# Altium project isg_cena_host_board_rev1.PrjPcb (part 1 of 2)
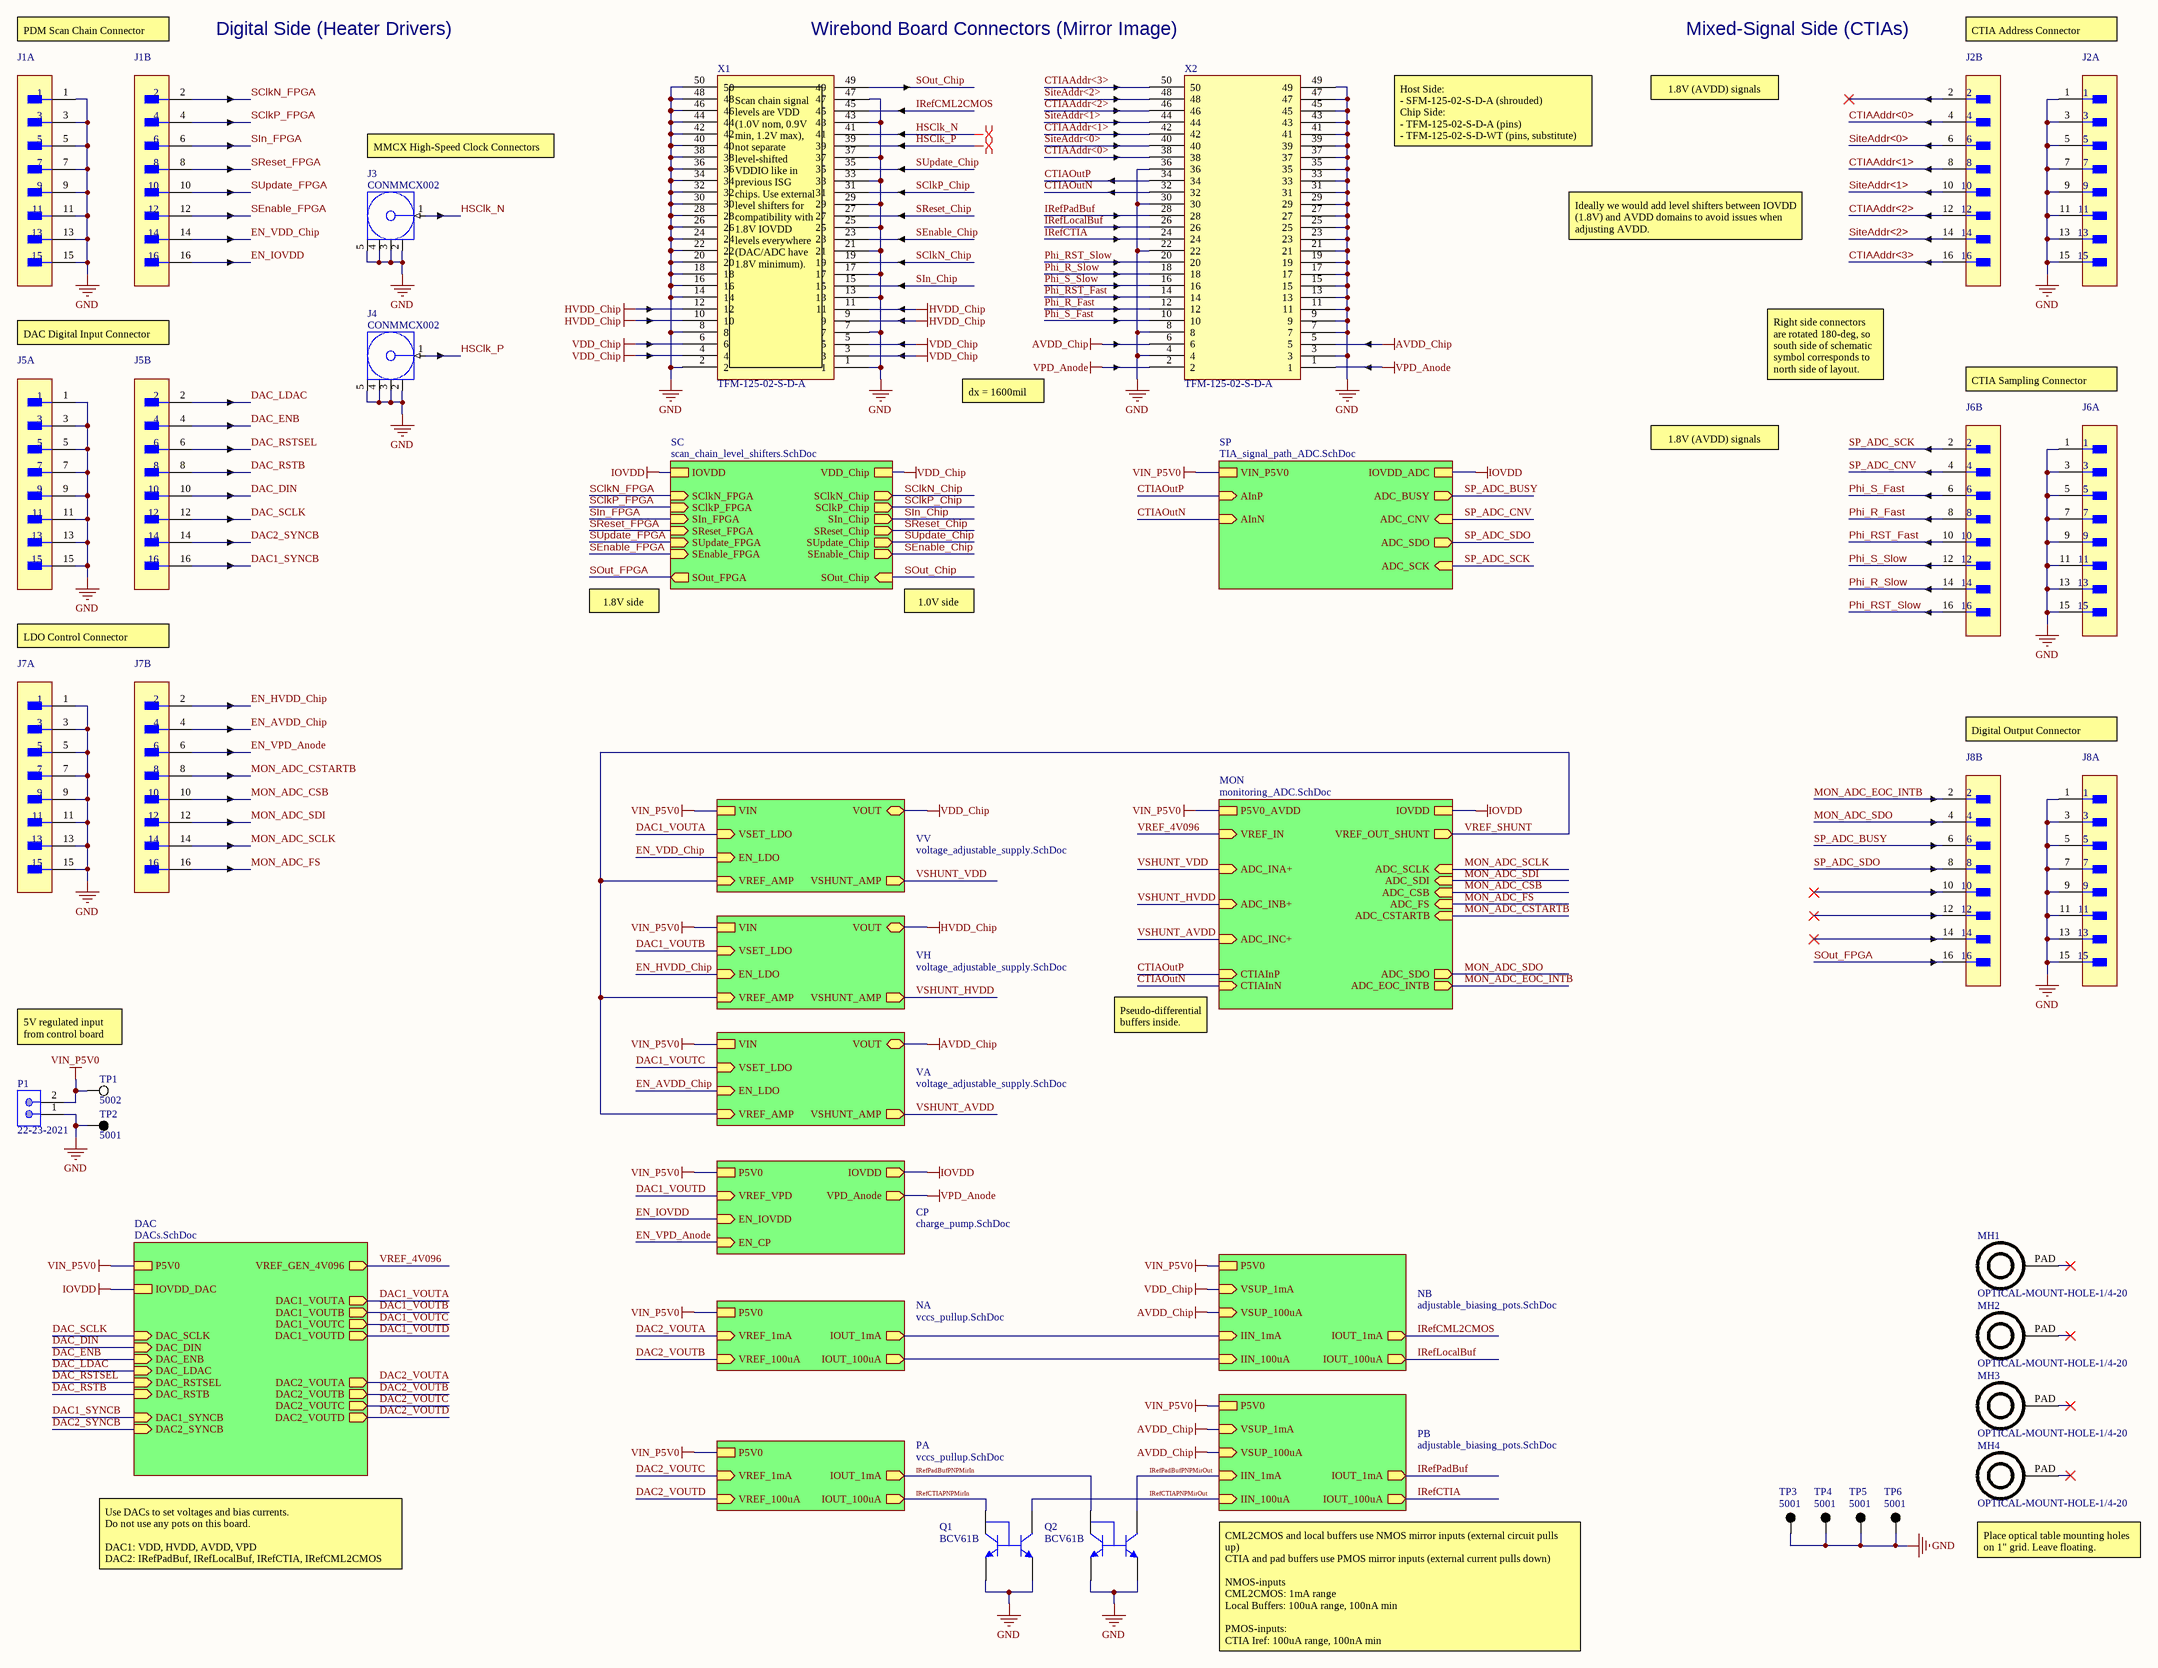
[diagram p0: isg_cena_host_board_rev1_top.SchDoc]
9 sheets, 317 parts. Net scope: hierarchical (ports join the sheet entries above them; power ports are global).
Board file: isg_cena_host_board_rev1.PcbDoc
Sheets:
  isg_cena_host_board_rev1_top.SchDoc
    VV = voltage_adjustable_supply.SchDoc
    VH = voltage_adjustable_supply.SchDoc
    VA = voltage_adjustable_supply.SchDoc
    NA = vccs_pullup.SchDoc
    PA = vccs_pullup.SchDoc
    PB = adjustable_biasing_pots.SchDoc
    NB = adjustable_biasing_pots.SchDoc
    CP = charge_pump.SchDoc
    DAC = DACs.SchDoc
    SP = TIA_signal_path_ADC.SchDoc
    SC = scan_chain_level_shifters.SchDoc
    MON = monitoring_ADC.SchDoc

## Sheet isg_cena_host_board_rev1_top.SchDoc
size C; SheetNumber: 1; SheetTotal: 9

### Parts
(Parts that share a designator on the sheet are numbered #1, #2 ... from top to bottom, then left to right.)
J1  (no value)  [FP-FTSH-108-02-F-DV]  (parts A,B of 2)
J2  (no value)  [FP-FTSH-108-02-F-DV]  (parts A,B of 2)
J3  CONMMCX002  [CON-MMCX-RA]
J4  CONMMCX002  [CON-MMCX-RA]
J5  (no value)  [FP-FTSH-108-02-F-DV]  (parts A,B of 2)
J6  (no value)  [FP-FTSH-108-02-F-DV]  (parts A,B of 2)
J7  (no value)  [FP-FTSH-108-02-F-DV]  (parts A,B of 2)
J8#1  (no value)  [FP-FTSH-108-02-F-DV]  (parts A,B of 2)
MH1  OPTICAL-MOUNT-HOLE-1/4-20  [MH-1/4-20]
MH2  OPTICAL-MOUNT-HOLE-1/4-20  [MH-1/4-20]
MH3  OPTICAL-MOUNT-HOLE-1/4-20  [MH-1/4-20]
MH4  OPTICAL-MOUNT-HOLE-1/4-20  [MH-1/4-20]
P1  22-23-2021  [MOLX-22-23-2021_V]
Q1  BCV61B  [INF-SOT143-4-1_V]
Q2  BCV61B  [INF-SOT143-4-1_V]
TP1  5002  [KSTN-5002]
TP2  5001  [KSTN-5001]
TP3  5001  [KSTN-5001]
TP4  5001  [KSTN-5001]
TP5  5001  [KSTN-5001]
TP6  5001  [KSTN-5001]
X1  TFM-125-02-S-D-A  [SAMTEC-TFM-125-02-X-D-A]
X2  TFM-125-02-S-D-A  [SAMTEC-TFM-125-02-X-D-A]

### Sub-sheets
CP = charge_pump.SchDoc: P5V0, EN_CP (in), IOVDD (out), VPD_Anode (out), VREF_VPD (in), EN_IOVDD (in)
DAC = DACs.SchDoc: P5V0, IOVDD_DAC, DAC1_VOUTA (out), DAC1_VOUTB (out), DAC1_VOUTC (out), DAC1_VOUTD (out), DAC2_VOUTA (out), DAC2_VOUTB (out), DAC2_VOUTC (out), DAC2_VOUTD (out), DAC_SCLK (in), DAC_DIN (in), DAC1_SYNCB (in), DAC_ENB (in), DAC_LDAC (in), DAC_RSTSEL (in), DAC_RSTB (in), DAC2_SYNCB (in), VREF_GEN_4V096 (out)
MON = monitoring_ADC.SchDoc: P5V0_AVDD, IOVDD, ADC_INA+ (in), ADC_INB+ (in), ADC_INC+ (in), CTIAInP (in), CTIAInN (in), ADC_SCLK (in), ADC_SDI (in), ADC_SDO (out), ADC_CSB (in), ADC_FS (in), ADC_CSTARTB (in), ADC_EOC_INTB (out), VREF_IN (in), VREF_OUT_SHUNT (out)
NA = vccs_pullup.SchDoc: P5V0, VREF_1mA (in), VREF_100uA (in), IOUT_1mA (out), IOUT_100uA (out)
NB = adjustable_biasing_pots.SchDoc: VSUP_1mA (in), IIN_1mA (in), IIN_100uA (in), IOUT_1mA (out), IOUT_100uA (out), VSUP_100uA (in), P5V0
PA = vccs_pullup.SchDoc: P5V0, VREF_1mA (in), VREF_100uA (in), IOUT_1mA (out), IOUT_100uA (out)
PB = adjustable_biasing_pots.SchDoc: VSUP_1mA (in), IIN_1mA (in), IIN_100uA (in), IOUT_1mA (out), IOUT_100uA (out), VSUP_100uA (in), P5V0
SC = scan_chain_level_shifters.SchDoc: VDD_Chip, IOVDD, SClkN_FPGA (in), SClkP_FPGA (in), SIn_FPGA (in), SReset_FPGA (in), SUpdate_FPGA (in), SEnable_FPGA (in), SClkN_Chip (out), SClkP_Chip (out), SIn_Chip (out), SReset_Chip (out), SUpdate_Chip (out), SEnable_Chip (out), SOut_FPGA (out), SOut_Chip (in)
SP = TIA_signal_path_ADC.SchDoc: VIN_P5V0, AInP (in), AInN (in), IOVDD_ADC, ADC_BUSY (out), ADC_CNV (in), ADC_SDO (out), ADC_SCK (in)
VA = voltage_adjustable_supply.SchDoc: VIN, VOUT (bidir), VSET_LDO (in), EN_LDO (in), VSHUNT_AMP (out), VREF_AMP (in)
VH = voltage_adjustable_supply.SchDoc: VIN, VOUT (bidir), VSET_LDO (in), EN_LDO (in), VSHUNT_AMP (out), VREF_AMP (in)
VV = voltage_adjustable_supply.SchDoc: VIN, VOUT (bidir), VSET_LDO (in), EN_LDO (in), VSHUNT_AMP (out), VREF_AMP (in)

### Nets
AVDD_Chip: X2.5 X2.6 ; sheet VA/VOUT, sheet PB/VSUP_1mA, sheet PB/VSUP_100uA, sheet NB/VSUP_100uA  [project net VOUT]
GND: J1.1 J1.3 J1.5 J1.7 J1.9 J1.11 J1.13 J1.15 J2.1 J2.3 J2.5 J2.7 J2.9 J2.11 J2.13 J2.15 J3.2(GND) J3.3(GND) J3.4(GND) J3.5(GND) J4.2(GND) J4.3(GND) J4.4(GND) J4.5(GND) J5.1 J5.3 J5.5 J5.7 J5.9 J5.11 J5.13 J5.15 J6.1 J6.3 J6.5 J6.7 J6.9 J6.11 J6.13 J6.15 J7.1 J7.3 J7.5 J7.7 J7.9 J7.11 J7.13 J7.15 J8#1.1 J8#1.3 J8#1.5 J8#1.7 J8#1.9 J8#1.11 J8#1.13 J8#1.15 P1.1 Q1.3(E1) Q1.4(E2) Q2.3(E1) Q2.4(E2) TP2.1 TP3.1 TP4.1 TP5.1 TP6.1 X1.1 X1.2 X1.7 X1.8 X1.13 X1.14 X1.16 X1.17 X1.18 X1.20 X1.21 X1.22 X1.24 X1.25 X1.26 X1.28 X1.29 X1.30 X1.32 X1.33 X1.34 X1.36 X1.37 X1.38 X1.40 X1.42 X1.43 X1.44 X1.46 X1.47 X1.48 X1.50 X2.3 X2.4 X2.7 X2.8 X2.9 X2.11 X2.13 X2.15 X2.17 X2.19 X2.21 X2.22 X2.23 X2.25 X2.27 X2.29 X2.30 X2.31 X2.33 X2.35 X2.36 X2.37 X2.39 X2.41 X2.43 X2.45 X2.47 X2.49
HVDD_Chip: X1.9 X1.10 X1.11 X1.12 ; sheet VH/VOUT  [project net VOUT]
IOVDD: sheet CP/IOVDD, sheet DAC/IOVDD_DAC, sheet SP/IOVDD_ADC, sheet SC/IOVDD, sheet MON/IOVDD
VDD_Chip: X1.3 X1.4 X1.5 X1.6 ; sheet VV/VOUT, sheet NB/VSUP_1mA, sheet SC/VDD_Chip  [project net VOUT]
VIN_P5V0: P1.2 TP1.1 ; sheet VV/VIN, sheet VH/VIN, sheet VA/VIN, sheet NA/P5V0, sheet PA/P5V0, sheet PB/P5V0, sheet NB/P5V0, sheet CP/P5V0, sheet DAC/P5V0, sheet SP/VIN_P5V0, sheet MON/P5V0_AVDD  [project net P5V0]
VPD_Anode: X2.1 X2.2 ; sheet CP/VPD_Anode
CTIAAddr<0>: J2.4 X2.38
CTIAAddr<1>: J2.8 X2.42
CTIAAddr<2>: J2.12 X2.46
CTIAAddr<3>: J2.16 X2.50
CTIAOutN: X2.32 ; sheet SP/AInN, sheet MON/CTIAInN
CTIAOutP: X2.34 ; sheet SP/AInP, sheet MON/CTIAInP
DAC1_SYNCB: J5.16 ; sheet DAC/DAC1_SYNCB
DAC1_VOUTA: sheet VV/VSET_LDO, sheet DAC/DAC1_VOUTA
DAC1_VOUTB: sheet VH/VSET_LDO, sheet DAC/DAC1_VOUTB
DAC1_VOUTC: sheet VA/VSET_LDO, sheet DAC/DAC1_VOUTC
DAC1_VOUTD: sheet CP/VREF_VPD, sheet DAC/DAC1_VOUTD
DAC2_SYNCB: J5.14 ; sheet DAC/DAC2_SYNCB
DAC2_VOUTA: sheet NA/VREF_1mA, sheet DAC/DAC2_VOUTA
DAC2_VOUTB: sheet NA/VREF_100uA, sheet DAC/DAC2_VOUTB
DAC2_VOUTC: sheet PA/VREF_1mA, sheet DAC/DAC2_VOUTC
DAC2_VOUTD: sheet PA/VREF_100uA, sheet DAC/DAC2_VOUTD
DAC_DIN: J5.10 ; sheet DAC/DAC_DIN
DAC_ENB: J5.4 ; sheet DAC/DAC_ENB
DAC_LDAC: J5.2 ; sheet DAC/DAC_LDAC
DAC_RSTB: J5.8 ; sheet DAC/DAC_RSTB
DAC_RSTSEL: J5.6 ; sheet DAC/DAC_RSTSEL
DAC_SCLK: J5.12 ; sheet DAC/DAC_SCLK
EN_AVDD_Chip: J7.4 ; sheet VA/EN_LDO  [project net EN]
EN_HVDD_Chip: J7.2 ; sheet VH/EN_LDO  [project net EN]
EN_IOVDD: J1.16 ; sheet CP/EN_IOVDD
EN_VDD_Chip: J1.14 ; sheet VV/EN_LDO  [project net EN]
EN_VPD_Anode: J7.6 ; sheet CP/EN_CP  [project net CP_EN_M]
HSClk_N: J3.1(Signal) X1.41
HSClk_P: J4.1(Signal) X1.39
IOUT_1mA: sheet NA/IOUT_1mA, sheet NB/IIN_1mA
IOUT_100uA: sheet NA/IOUT_100uA, sheet NB/IIN_100uA
IRefCML2CMOS: X1.45 ; sheet NB/IOUT_1mA
IRefCTIA: X2.24 ; sheet PB/IOUT_100uA
IRefCTIAPNPMirIn: Q1.1(C2) ; sheet PA/IOUT_100uA  [project net IOUT_100uA]
IRefCTIAPNPMirOut: Q1.2(C1) ; sheet PB/IIN_100uA
IRefLocalBuf: X2.26 ; sheet NB/IOUT_100uA
IRefPadBuf: X2.28 ; sheet PB/IOUT_1mA
IRefPadBufPNPMirIn: Q2.1(C2) ; sheet PA/IOUT_1mA  [project net IOUT_1mA]
IRefPadBufPNPMirOut: Q2.2(C1) ; sheet PB/IIN_1mA
MON_ADC_CSB: J7.10 ; sheet MON/ADC_CSB
MON_ADC_CSTARTB: J7.8 ; sheet MON/ADC_CSTARTB
MON_ADC_EOC_INTB: J8#1.2 ; sheet MON/ADC_EOC_INTB
MON_ADC_FS: J7.16 ; sheet MON/ADC_FS
MON_ADC_SCLK: J7.14 ; sheet MON/ADC_SCLK
MON_ADC_SDI: J7.12 ; sheet MON/ADC_SDI
MON_ADC_SDO: J8#1.4 ; sheet MON/ADC_SDO
Phi_R_Fast: J6.8 X2.12
Phi_R_Slow: J6.14 X2.18
Phi_RST_Fast: J6.10 X2.14
Phi_RST_Slow: J6.16 X2.20
Phi_S_Fast: J6.6 X2.10
Phi_S_Slow: J6.12 X2.16
SClkN_Chip: X1.19 ; sheet SC/SClkN_Chip
SClkN_FPGA: J1.2 ; sheet SC/SClkN_FPGA
SClkP_Chip: X1.31 ; sheet SC/SClkP_Chip
SClkP_FPGA: J1.4 ; sheet SC/SClkP_FPGA
SEnable_Chip: X1.23 ; sheet SC/SEnable_Chip
SEnable_FPGA: J1.12 ; sheet SC/SEnable_FPGA
SIn_Chip: X1.15 ; sheet SC/SIn_Chip
SIn_FPGA: J1.6 ; sheet SC/SIn_FPGA
SiteAddr<0>: J2.6 X2.40
SiteAddr<1>: J2.10 X2.44
SiteAddr<2>: J2.14 X2.48
SOut_Chip: X1.49 ; sheet SC/SOut_Chip
SOut_FPGA: J8#1.16 ; sheet SC/SOut_FPGA
SP_ADC_BUSY: J8#1.6 ; sheet SP/ADC_BUSY
SP_ADC_CNV: J6.4 ; sheet SP/ADC_CNV  [project net ADC_CNV]
SP_ADC_SCK: J6.2 ; sheet SP/ADC_SCK  [project net ADC_SCK]
SP_ADC_SDO: J8#1.8 ; sheet SP/ADC_SDO  [project net ADC_SDO]
SReset_Chip: X1.27 ; sheet SC/SReset_Chip
SReset_FPGA: J1.8 ; sheet SC/SReset_FPGA
SUpdate_Chip: X1.35 ; sheet SC/SUpdate_Chip
SUpdate_FPGA: J1.10 ; sheet SC/SUpdate_FPGA
VREF_4V096: sheet DAC/VREF_GEN_4V096, sheet MON/VREF_IN  [project net DAC_VREF_4V096]
VREF_SHUNT: sheet VV/VREF_AMP, sheet VH/VREF_AMP, sheet VA/VREF_AMP, sheet MON/VREF_OUT_SHUNT
VSHUNT_AVDD: sheet VA/VSHUNT_AMP, sheet MON/ADC_INC+
VSHUNT_HVDD: sheet VH/VSHUNT_AMP, sheet MON/ADC_INB+
VSHUNT_VDD: sheet VV/VSHUNT_AMP, sheet MON/ADC_INA+

Not connected (* = marked no-connect by the designer): J2 2*; J8#1 10* 12* 14*; MH1 PAD*; MH2 PAD*; MH3 PAD*; MH4 PAD*

### Layout directives
differential pair: HSClk_N, HSClk_P

### Notes on the sheet
- PDM Scan Chain Connector
- Digital Side (Heater Drivers)
- Wirebond Board Connectors (Mirror Image)
- Mixed-Signal Side (CTIAs)
- CTIA Address Connector
- 1.8V (AVDD) signals
- MMCX High-Speed Clock Connectors
- Host Side:
  - SFM-125-02-S-D-A (shrouded)
  Chip Side:
  - TFM-125-02-S-D-A (pins)
  - TFM-125-02-S-D-WT (pins, substitute)
- Ideally we would add level shifters between IOVDD (1.8V) and AVDD domains to avoid issues when adjusting AVDD.
- DAC Digital Input Connector
- (near X1) Scan chain signal levels are VDD (1.0V nom, 0.9V min, 1.2V max), not separate level-shifted VDDIO like in previous ISG chips. Use external level shifters for compatibility with 1.8V IOVDD levels everywhere (DAC/ADC have 1.8V minimum).
- Right side connectors are rotated 180-deg, so south side of schematic symbol corresponds to north side of layout.
- CTIA Sampling Connector
- dx = 1600mil
- 1.8V side
- 1.0V side
- LDO Control Connector
- Digital Output Connector
- Pseudo-differential buffers inside.
- 5V regulated input from control board
- Place optical table mounting holes on 1" grid. Leave floating.
- Use DACs to set voltages and bias currents.
  Do not use any pots on this board.
  DAC1: VDD, HVDD, AVDD, VPD
  DAC2: IRefPadBuf, IRefLocalBuf, IRefCTIA, IRefCML2CMOS
- CML2CMOS and local buffers use NMOS mirror inputs (external circuit pulls up)
  CTIA and pad buffers use PMOS mirror inputs (external current pulls down)
  NMOS-inputs
  CML2CMOS: 1mA range
  Local Buffers: 100uA range, 100nA min
  PMOS-inputs:
  CTIA Iref: 100uA range, 100nA min
  Pad Buffers: 1mA range

### Library data of the parts
J1 J2 J5-J7 J8#1 = FP-FTSH-108-02-F-DV: CONN HEADER SMD 16POS 1.27MM; Manufacturer: Samtec; Standoff Height: 0.46mm; Conn Orientation: Vertical; Current Rating: 3.4A; Number Of Contacts: 16; Conn Gender: Male; Lead Free: Yes; Package: FTSH-108-02-F-DV; Footprint Url: http://suddendocs.samtec.com/prints/ftsh-1xx-xx-xxx-dv-xxx-footprint.pdf; Automotive: No; Pitch: 1.27mm; Manufacturer Part Number: FTSH-108-02-F-DV; Device Class L2: Headers and Wire Housings; ComponentLink2URL: http://suddendocs.samtec.com/prints/ftsh-1xx-xx-xxx-dv-xxx-xxx-mkt.pdf; ComponentLink2Description: Datasheet; Octopart: https://octopart.com/ftsh-108-02-f-dv-samtec-10605893; RoHS: TRUE; Digikey Description: CONN HEADER SMD 16POS 1.27MM; Device Class L1: Connectors; Temperature Range High: +125°C; Temperature: -55°C to +125°C; Device Class L3: unset; Category: Conn; Temperature Range Low: -55°C; Number Of Rows: 2; Contact Material: Gold,Nickel; Mouser Description: Conn Unshrouded Header HDR 16 POS 1.27mm Solder ST SMD Tube; Height: 5.09mm
J3 J4 = CMP-0168-00017-1: MMCX Female Right Angle PCB Mount Connector, Thru-Hole; PCB_Layout: Pads complies with manufacturer's recommendation.; PackageVersion: rev1.0, Jun-2007; PackageDescription: MMCX Female Right Angle PCB Mount Connector, Thru-Hole, 3.45 x 3.45 mm Body; DatasheetVersion: rev1.0, Jun-2007; PackageReference: CON-MMCX-RA
P1 = CMP-1704-00001-3: Male Header, Pitch 2.54 mm, 1 x 2 Position, Height 10.67 mm, Tail Length 3.56 mm, 0 to 75 degC, RoHS, Bulk; Package Quantity: 3000; Height: 10.67 mm; RoHSCompliant: True; ComponentLink2URL: https://datasheet.ciiva.com/19454/232266-19454304.pdf; PartNumber: 22-23-2021; Packaging: Bulk; ComponentLink2Description: Datasheet; Min Operating Temperature: 0 degC; ComponentLink1Description: Manufacturer URL; Length: 5.08 mm; Mounting Technology: Through Hole; Max Operating Temperature: 75 degC; REACH SVHC: Unknown; PackageDescription: Male Header, Pitch 2.54 mm, 1 x 2 Position, Height 10.67 mm, Tail Length 3.56 mm; ComponentLink1URL: http://www.molex.com/; Mount: Through Hole; Radiation Hardening: No; Width: 6.35 mm; Pins: 2
Q1 Q2 = CMP-1190-00001-1: NPN Silicon Double Transistor, 30 V VCEO, 100 mA IC, SOT143-4-1, Reel, Green; Manufacturer: Infineon; VCEO (max): 30Â V; Ptot (max): 300 mW; Green: TRUE; ICBO (max): 15Â nA; IC (max): 100 mA; IC: 2 mA; VCE (max): 5Â V; VEBO (max): 6Â V; ICM (max): 200Â mA; fT (typ): 250Â MHz; Polarity: NPN; PartNumber: BCV61B; ComponentLink1Description: Manufacturer URL; PackageDescription: 4-Pin Small Outline Transistor Package, 1.3 x 2.9 mm Body; ComponentLink1URL: http://www.infineon.com/; ComponentLink2Description: Datasheet; Mounting Technology: Surface Mount; ComponentLink3URL: http://www.infineon.com/dgdl/SOT143-Package_Overview.pdf?folderId=db3a30431936bc4b011952ce8b1b3bed&fileId=db3a30431936bc4b011952df42203c0c; Packing: Reel; VCBO (max): 30Â V; ComponentLink2URL: http://www.infineon.com/dgdl/bcv61.pdf?folderId=db3a30431441fb5d0114498f7eab01ce&fileId=db3a30431441fb5d011449d8ff720246; PackageReference: SOT143-4-1; VCE: 5Â V; ComponentLink3Description: Package Specification
TP1 = CMP-2000-05182-1: Test Point, White, 1-Pin THD, RoHS, Bulk; Manufacturer: KeystoneElectronics; Outside Diameter: 2.54mm; Plating: Silver; Mounting Hole Size: 1mm; Product: TestPoints; Packaging: Bulk; Manufacturer URL: http://www.keyelco.com/; Length: 7.62mm; Datasheet Version: Rev. G, 12/2008; Type: Miniature; Product Category: CircuitBoardHardware-PCB; Material: Nylon; RoHS: True; Contact Material: PhosphorBronze; Datasheet URL: https://ciiva.com/datasheet-click-2917627?src=ciiva&sig=bd195616; Color: White; Brand: KeystoneElectronics
TP2-TP6 = CMP-2000-05181-1: Test Point, Black, 1-Pin THD, RoHS, Bulk; Manufacturer: Keystone; Other Names: 5001K; Catalog Drawings: 5000Series; Alternate Color: 5004K-ND / -TESTPOINTPCMINI.040"DYELLOW / 5003K-ND / -TESTPOINTPCMINI.040"DORANGE / 5002K-ND / -TESTPOINTPCMINI.040"DWHITE / 5000K-ND / -TESTPOINTPCMINI.040"DRED; Kits: DKTGRS232C-KIT-ND / -TTLCONVERTER; Online Catalog: ColorCodedTestPoints; Datasheet URL: https://ciiva.com/datasheet-click-2917627?src=ciiva&sig=bd195616; Mounting Type: 0.040"(1.02mm)HoleDiameter; Family: TestPoints; RoHS Information: RoHSComplianceStatement; Datasheet Version: Rev. G, 12/2008; Color: Black; Category: TestandMeasurement; Standard Package: 100; Manufacturer URL: http://www.keyelco.com/; Material: Base,Nylon46,UL94V-0; Type: PCTestPoint,Miniature; Terminal: 0.010"x0.020"(0.25mmx0.51mm)PhosphorBronzeWire,SilverPlated; Series: THM; Packaging: Bulk
X1 X2 = TFM-125-02-X-D-A: SAMTEC TFM-125-02-X-D-A

## Sheet voltage_adjustable_supply.SchDoc
size A; SheetNumber: 3; SheetTotal: 9
Used 3 times, as channels VV, VH, VA. Parts and nets are listed once, with the designators drawn on the sheet.
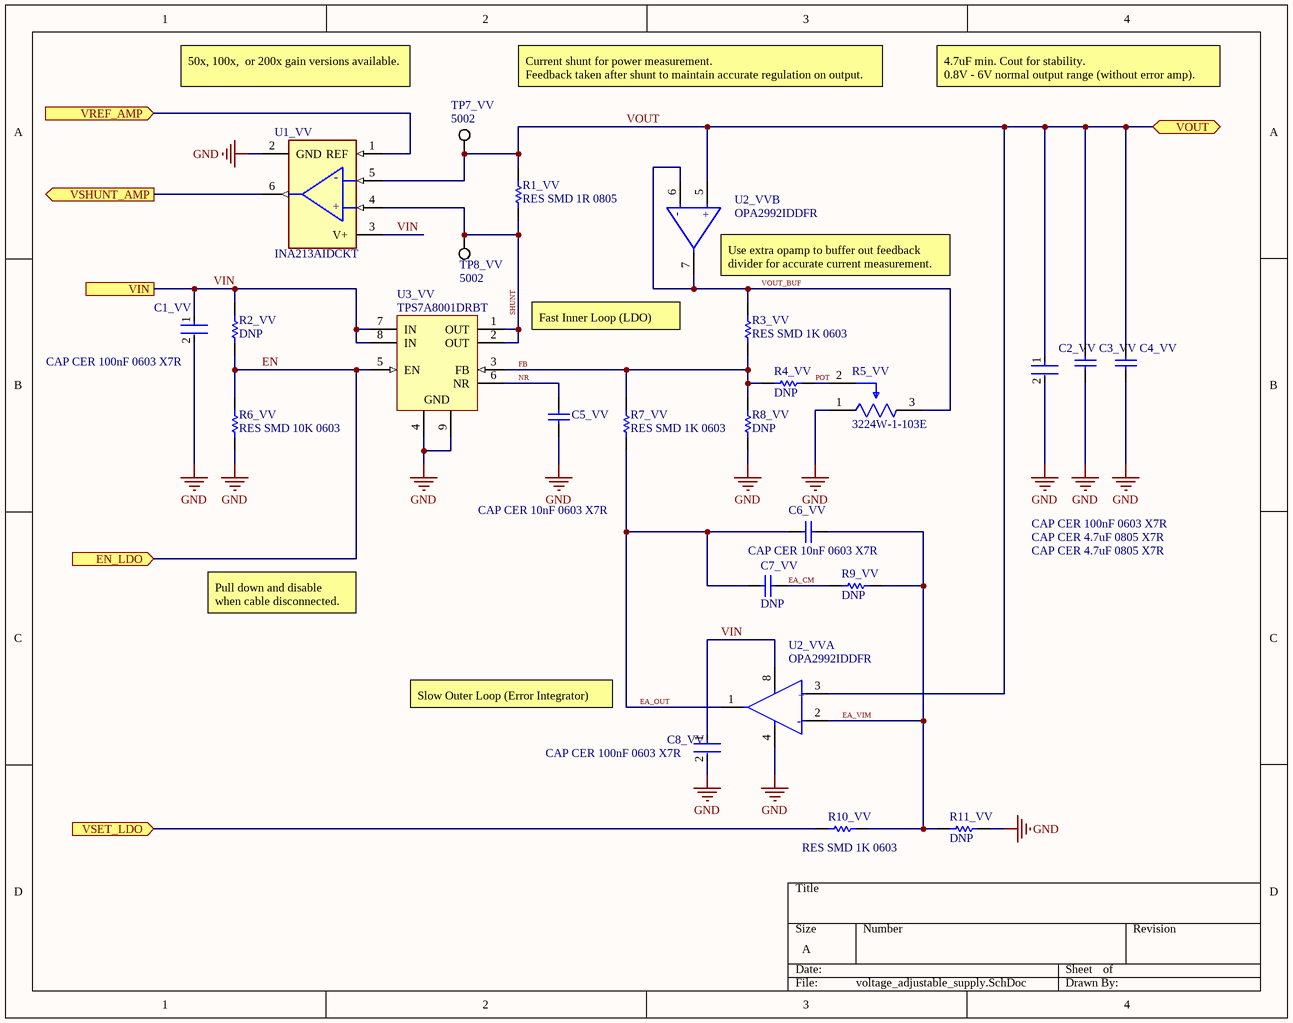
[diagram p1: voltage_adjustable_supply.SchDoc]

### Parts
C1_VV  CAP CER 100nF 0603 X7R  [FP-CC0603-DA-MFG]
C2_VV  CAP CER 100nF 0603 X7R  [FP-CC0603-DA-MFG]
C3_VV  CAP CER 4.7uF 0805 X7R  [CAPC2013X140X50NL20T25]
C4_VV  CAP CER 4.7uF 0805 X7R  [CAPC2013X140X50NL20T25]
C5_VV  CAP CER 10nF 0603 X7R  [CAPC1608X90X40ML10T20]
C6_VV  CAP CER 10nF 0603 X7R  [CAPC1608X90X40ML10T20]
C7_VV  DNP  [CAPC1608X90X40ML10T20]
C8_VV  CAP CER 100nF 0603 X7R  [FP-CC0603-DA-MFG]
R1_VV  RES SMD 1R 0805  [RESC2013X50X30NL20T20]
R2_VV  DNP  [RESC1609X50X30LL10T20]
R3_VV  RES SMD 1K 0603  [RESC1609X50X30LL10T20]
R4_VV  DNP  [RESC1609X50X30LL10T20]
R5_VV  3224W-1-103E  [FP-3224W-MFG]
R6_VV  RES SMD 10K 0603  [RESC1609X50X30LL10T20]
R7_VV  RES SMD 1K 0603  [RESC1609X50X30LL10T20]
R8_VV  DNP  [RESC1609X50X30LL10T20]
R9_VV  DNP  [RESC1609X50X30LL10T20]
R10_VV  RES SMD 1K 0603  [RESC1609X50X30LL10T20]
R11_VV  DNP  [RESC1609X50X30LL10T20]
TP7_VV  5002  [KSTN-5002]
TP8_VV  5002  [KSTN-5002]
U1_VV  INA213AIDCKT  [FP-DCK0006A-MFG]
U2_VV  OPA2992IDDFR  [FP-DDF0008A-MFG]  (parts A,B of 2)
U3_VV  TPS7A8001DRBT  [DRB0008A_V]

### Ports
EN_LDO (in), VIN, VOUT (bidir), VREF_AMP (in), VSET_LDO (in), VSHUNT_AMP (out)

### Nets
GND: C1_VV.2 C2_VV.2 C3_VV.2 C4_VV.2 C5_VV.2 C8_VV.2 R5_VV.1(CCW) R6_VV.1 R8_VV.1 R11_VV.1 U1_VV.2(GND) U2_VV.4(V-) U3_VV.4(GND) U3_VV.9(GND)
EA_CM: C7_VV.2 R9_VV.2
EA_OUT: C6_VV.1 C7_VV.1 R7_VV.1 U2_VV.1(OUT1)
EA_VIM: C6_VV.2 R9_VV.1 R10_VV.1 R11_VV.2 U2_VV.2(IN1-)
EN: R2_VV.1 R6_VV.2 U3_VV.5(EN) ; port EN_LDO
FB: R3_VV.1 R4_VV.2 R7_VV.2 R8_VV.2 U3_VV.3(FB)
NR: C5_VV.1 U3_VV.6(NR)
POT: R4_VV.1 R5_VV.2(WIPER)
SHUNT: R1_VV.1 TP8_VV.1 U1_VV.4(IN+) U3_VV.1(OUT) U3_VV.2(OUT)
VIN: C1_VV.1 C8_VV.1 R2_VV.2 U1_VV.3(V+) U2_VV.8(V+) U3_VV.7(IN) U3_VV.8(IN) ; port VIN
VOUT: C2_VV.1 C3_VV.1 C4_VV.1 R1_VV.2 TP7_VV.1 U1_VV.5(IN-) U2_VV.3(IN1+) U2_VV.5(IN2+) ; port VOUT
VOUT_BUF: R3_VV.2 R5_VV.3(CW) U2_VV.6(IN2-) U2_VV.7(OUT2)
VREF_AMP: U1_VV.1(REF) ; port VREF_AMP
VSET_LDO: R10_VV.2 ; port VSET_LDO
VSHUNT_AMP: U1_VV.6(OUT) ; port VSHUNT_AMP

### Channels
VV: designators end in _VV; ports EN_LDO=EN VIN=P5V0 VOUT=VOUT VREF_AMP=VREF_SHUNT VSET_LDO=DAC1_VOUTA VSHUNT_AMP=VSHUNT_VDD
VH: designators end in _VH; ports EN_LDO=EN VIN=P5V0 VOUT=VOUT VREF_AMP=VREF_SHUNT VSET_LDO=DAC1_VOUTB VSHUNT_AMP=VSHUNT_HVDD
VA: designators end in _VA; ports EN_LDO=EN VIN=P5V0 VOUT=VOUT VREF_AMP=VREF_SHUNT VSET_LDO=DAC1_VOUTC VSHUNT_AMP=VSHUNT_AVDD

### Notes on the sheet
- 50x, 100x,  or 200x gain versions available.
- Current shunt for power measurement.
  Feedback taken after shunt to maintain accurate regulation on output.
- 4.7uF min. Cout for stability.
  0.8V - 6V normal output range (without error amp).
- (near U2_VV) Use extra opamp to buffer out feedback divider for accurate current measurement.
- Fast Inner Loop (LDO)
- Pull down and disable when cable disconnected.
- Slow Outer Loop (Error Integrator)
- (in symbol CMP-04895-000035-1) -; +
- (in symbol CMP-04895-000462-1, part A) +; -
- (in symbol CMP-04895-000462-1, part B) +; -

### Library data of the parts
C1_VV C2_VV C8_VV = CMP-03422-000030-1: CAP CER 0.1UF 16V X7R 0603; Manufacturer Part Number: CC0603KRX7R7BB104; Manufacturer: YAGEO; Tolerance: 0.1; Temperature Coefficient: 15%; Material: Ceramic; Voltage Rating: 16 V; Package: CC0603-DA; ComponentLink2Description: Datasheet; Octopart: https://octopart.com/cc0603krx7r7bb104-yageo-192941; Temperature Range High: +125°C; Digikey Description: CAP CER 0.1UF 16V X7R 0603; Value: 100 nF; Voltage: 16 V; Device Class L2: Capacitors; Height: 0.9mm; Temperature: -55°C to +125°C; Device Class L1: Passive Components; Device Class L3: Ceramic Capacitors; ComponentLink2URL: http://www.yageo.com/documents/recent/UPY-GPHC_X7R_6.3V-to-50V_18.pdf; Footprint Url: http://www.yageo.com/exep/pages/download/literatures/UPY-C_GEN_24.pdf; RoHS: TRUE; Temperature Range Low: -55°C; Temperature Characteristic: X7R; Lead Free: Yes; Capacitance: 100 nF; Category: Cap; Mouser Description: Multilayer Ceramic Capacitor, CC Series, 0.1 - F, - 10%, X7R, 16 V, 0603 [1608 Metric]; Automotive: No
C3_VV C4_VV = CMP-2007-04677-1: Part Number: 0805ZC475KAT2A; Manufacturer: AVX Interconnect / Elco
C5_VV C6_VV = CMP-2100-03600-1: Chip Capacitor, 10 nF, +/- 10%, 50 V, -55 to 125 degC, 0603 (1608 Metric), RoHS, Tape and Reel; Manufacturer: Yageo; Insulation Resistance: 100GR; Voltage Rating (DC): 50V; Material: Ceramic; Lead Free: LeadFree; Case/Package: 0603; Datasheet Version: Rev. 15, 10/2016; Composition: Ceramic; Radiation Hardening: No; Thickness: 0.035inch; RoHSCompliant: True; Dielectric: X7R; Termination: SMD/SMT; Capacitance: 10nF; Manufacturer URL: http://www.yageo.com/; Tolerance: 10%; REACH SVHC: NoSVHC; Voltage: 50V; Max Operating Temperature: 125degC; Case Code (Metric): 1608; Package Quantity: 1; Case Code (Imperial): 0603; Packaging: TapeandReel; Package Reference: 0603; Width: 0.031inch; Datasheet URL: http://www.yageo.com/documents/recent/UPY-GPHC_X7R_6.3V-to-50V_15.pdf; Length: 1.6mm; Min Operating Temperature: -55degC; Number of Pins: 2; Depth: 0.8mm; Mount: SurfaceMount; Height: 0.8mm; Voltage Rating: 50V; Package Description: 2-Pin Surface Mount Device, Body 1.6 x 0.8 mm
C7_VV = CMP-2100-03600-1: Chip Capacitor, 10 nF, +/- 10%, 50 V, -55 to 125 degC, 0603 (1608 Metric), RoHS, Tape and Reel; Manufacturer: Yageo; Insulation Resistance: 100GR; Dielectric: X7R; Voltage Rating (DC): 50V; Capacitance: 10nF; Material: Ceramic; Lead Free: LeadFree; Case/Package: 0603; Datasheet Version: Rev. 15, 10/2016; Composition: Ceramic; Radiation Hardening: No; Thickness: 0.035inch; RoHSCompliant: True; Termination: SMD/SMT; Manufacturer URL: http://www.yageo.com/; Tolerance: 10%; REACH SVHC: NoSVHC; Voltage: 50V; Max Operating Temperature: 125degC; Case Code (Metric): 1608; Package Quantity: 1; Case Code (Imperial): 0603; Packaging: TapeandReel; Package Reference: 0603; Width: 0.031inch; Datasheet URL: http://www.yageo.com/documents/recent/UPY-GPHC_X7R_6.3V-to-50V_15.pdf; Length: 1.6mm; Min Operating Temperature: -55degC; Number of Pins: 2; Depth: 0.8mm; Mount: SurfaceMount; Height: 0.8mm; Voltage Rating: 50V; Package Description: 2-Pin Surface Mount Device, Body 1.6 x 0.8 mm
R1_VV = CMP-2001-04897-1: Manufacturer: Vishay Dale; Part Number: CRCW08050000Z0EB
R2_VV R4_VV R8_VV R9_VV R11_VV = CMP-2000-03820-1: Part Number: CRCW0603100KFKEA; Manufacturer: Vishay Dale
R3_VV R6_VV R7_VV R10_VV = CMP-2000-03820-1: DNP; Part Number: CRCW0603100KFKEA; Manufacturer: Vishay Dale
R5_VV = CMP-07234-000002-1: TRIMMER 10K OHM 0.25W J LEAD TOP; Manufacturer: Bourns; Tolerance: 10%; Resistance: 10kΩ; Temperature Coefficient: 100ppm/°C; Value: 10kΩ; Standoff Height: 0.2mm; Voltage Rating: 300V; Power Rating: 250mW; Device Class L3: Variable Resistors and Potentiometers; Composition: Cermet; Temperature Range Low: -65°C; Package: 3224W; ComponentLink2Description: Datasheet; Digikey Description: TRIMMER 10K OHM 0.25W J LEAD TOP; Category: Res; Mouser Description: Trimmer Resistors - SMD 4mm 10Kohms 10% Square Cermet Sealed; Temperature: -65°C to +150°C; Device Class L2: Resistors; Device Class L1: Passive Components; RoHS: TRUE; Temperature Range High: +150°C; Manufacturer Part Number: 3224W-1-103E; ComponentLink2URL: https://upverter.com/datasheet/a166fca85da25564670351d2dc712345c058bc40.pdf; Series: 3224; Height: 5.55mm; Lead Free: Yes; Octopart: https://octopart.com/3224w-1-103e-bourns-14818; Automotive: No
TP7_VV TP8_VV = CMP-2000-05182-1: as TP1 on sheet isg_cena_host_board_rev1_top; Product: TestPoints; Packaging: Bulk; Manufacturer URL: http://www.keyelco.com/; Length: 7.62mm; Datasheet Version: Rev. G, 12/2008; Type: Miniature; Product Category: CircuitBoardHardware-PCB; Material: Nylon; RoHS: True; Contact Material: PhosphorBronze; Datasheet URL: https://ciiva.com/datasheet-click-2917627?src=ciiva&sig=bd195616; Color: White; Brand: KeystoneElectronics
U1_VV = CMP-04895-000035-1: IC CURR SENSE 1 CIRCUIT SC70-6; Manufacturer: Texas Instruments; Standoff Height: 0mm; Input Bias Current: 35uA; Max Junction Temp: +150°C; Number Of Channels: 1; Max Supply Voltage: 26V; Min Supply Voltage: 2.7V; Nominal Supply Current: 100uA; Gain Bandwidth: 80kHz; Height: 0.8mm; Device Class L3: Amplifiers - Op Amps; Category: IC; Device Class L1: Integrated Circuits (ICs); Digikey Description: IC CURR SENSE 1 CIRCUIT SC70-6; Temperature Range High: +125°C; Device Class L2: Linear ICs; Package: DCK0006A; Mouser Description: SP Amp Current Shunt Monitor Single 26V 6-Pin SC-70 T/R; RoHS: TRUE; Automotive: No; Octopart: https://octopart.com/ina213aidckt-texas+instruments-7767892; Lead Free: Yes; Manufacturer Part Number: INA213AIDCKT; Temperature Range Low: -40°C; Ambient Temperature Range High: +125°C; ComponentLink2URL: http://www.ti.com/lit/ds/symlink/ina211.pdf; Ambient Temperature Range Low: -40°C; Temperature: -40°C to +125°C; ComponentLink2Description: Datasheet
U2_VV = CMP-04895-000462-1: IC OPAMP GP 2 CIRCUIT TSOT23-8
U3_VV = CMP-0395-00597-2: Single Output LDO, 1 A, Adjustable 0.8 to 6 V Output, 2.2 to 6.5 V Input, with High-Bandwidth PSRR, 8-pin SON (DRB), -40 to 125 degC, Green (RoHS & no Sb/Br); Manufacturer: Texas Instruments; Vin(Min)(V): 2.2; Iq(Typ)(mA): 0.04; Vout Adj(Max)(V): 6; SubFamily: Single Channel LDO; Accuracy(%): 3; Vin(Max)(V): 6.5; Vdo(Typ)(mV): 170; Vout Adj(Min)(V): 0.8; Iout(Max)(A): 1; PackageReference: DRB0008A; ComponentLink3URL: http://www.ti.com/litv/pdf/mpds118h; Eco-Plan: Green (RoHS & no Sb/Br); ComponentLink2Description: Datasheet; PackageVersion: 4203482-2/K; PackageDescription: 8-Pin Plastic Small Outline, Body 3 x 3 mm, Pitch 0.65 mm; ComponentLink2URL: http://www.ti.com/general/docs/lit/getliterature.tsp?genericPartNumber=TPS7A8001&fileType=pdf; ComponentLink1Description: Manufacturer URL; DatasheetVersion: SBVS135G; ComponentLink1URL: http://www.ti.com/; Mounting Technology: Surface Mount; PartNumber: TPS7A8001DRBT; ComponentLink3Description: Package Specification

## Sheet vccs_pullup.SchDoc
size A; SheetNumber: 4; SheetTotal: 9
Used 2 times, as channels NA, PA. Parts and nets are listed once, with the designators drawn on the sheet.
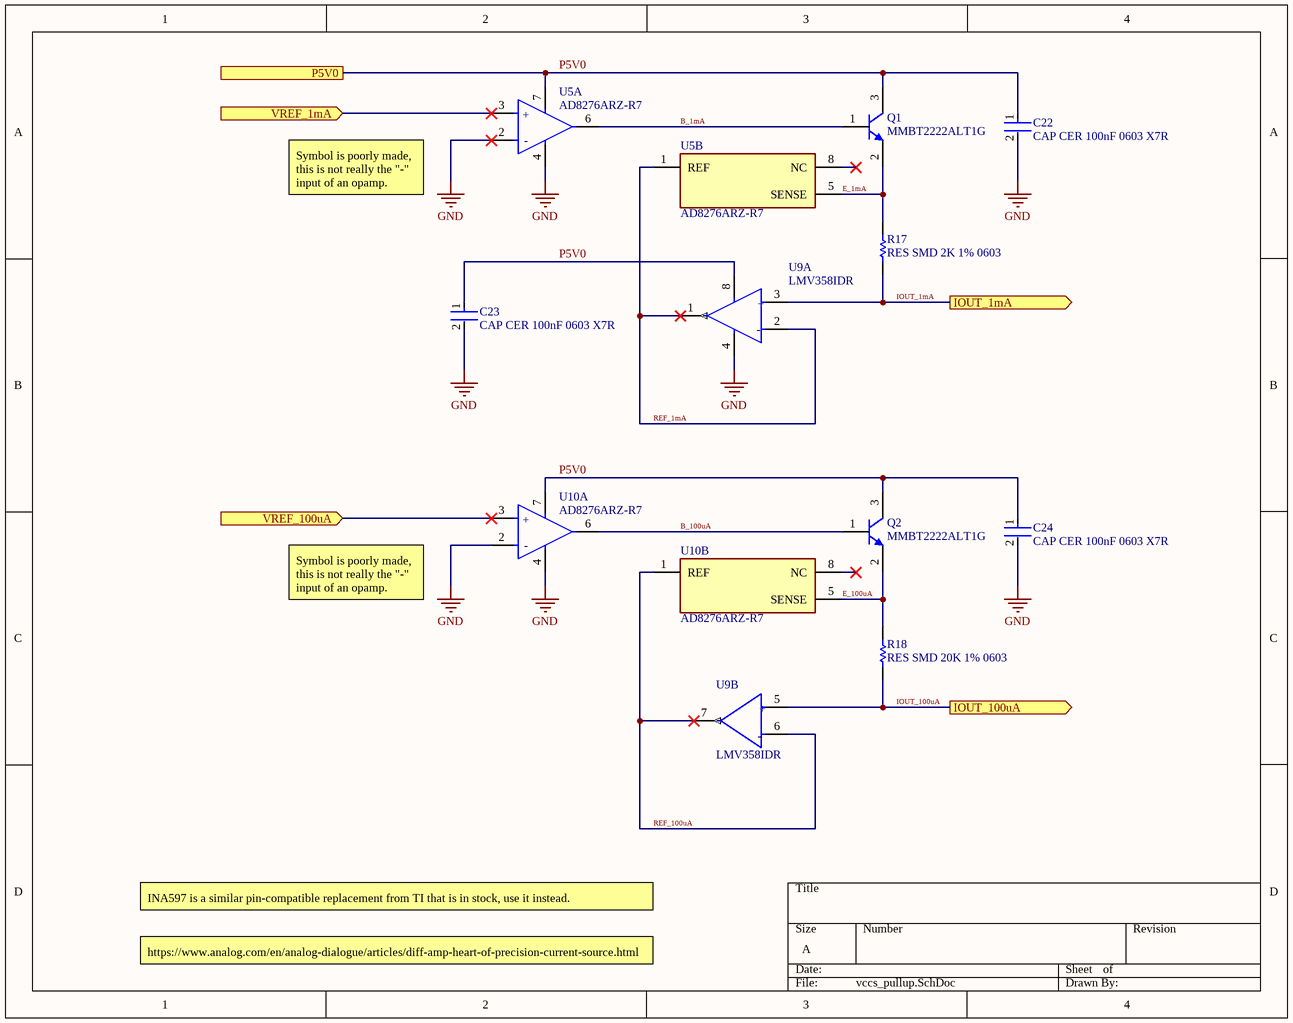
[diagram p2: vccs_pullup.SchDoc]

### Parts
C22  CAP CER 100nF 0603 X7R  [FP-CC0603-DA-MFG]
C23  CAP CER 100nF 0603 X7R  [FP-CC0603-DA-MFG]
C24  CAP CER 100nF 0603 X7R  [FP-CC0603-DA-MFG]
Q1  MMBT2222ALT1G  [ONSC-SOT-23-3-318-08_V]
Q2  MMBT2222ALT1G  [ONSC-SOT-23-3-318-08_V]
R17  RES SMD 2K 1% 0603  [RESC1609X50X30LL10T20]
R18  RES SMD 20K 1% 0603  [RESC1609X50X30LL10T20]
U5  AD8276ARZ-R7  [FP-R-8-IPC_C]  (parts A,B of 2)
U9  LMV358IDR  [FP-D0008A-MFG]  (parts A,B of 2)
U10  AD8276ARZ-R7  [FP-R-8-IPC_C]  (parts A,B of 2)

### Ports
IOUT_1mA (out), IOUT_100uA (out), P5V0, VREF_1mA (in), VREF_100uA (in)

### Nets
GND: C22.2 C23.2 C24.2 U5.2(-IN) U5.4(-VS) U9.4(GND) U10.2(-IN) U10.4(-VS)
B_1mA: Q1.1(B) U5.6(OUT)
B_100uA: Q2.1(B) U10.6(OUT)
E_1mA: Q1.2(E) R17.2 U5.5(SENSE)
E_100uA: Q2.2(E) R18.2 U10.5(SENSE)
IOUT_1mA: R17.1 U9.3(1IN+) ; port IOUT_1mA
IOUT_100uA: R18.1 U9.5(2IN+) ; port IOUT_100uA
P5V0: C22.1 C23.1 C24.1 Q1.3(C) Q2.3(C) U5.7(+VS) U9.8(VCC+) U10.7(+VS) ; port P5V0
REF_1mA: U5.1(REF) U9.1(OUT) U9.2(1IN-)
REF_100uA: U9.6(2IN-) U9.7(2OUT) U10.1(REF)
VREF_1mA: U5.3(+IN) ; port VREF_1mA
VREF_100uA: U10.3(+IN) ; port VREF_100uA

Not connected (* = marked no-connect by the designer): U5 8(NC)*; U10 8(NC)*

### Channels
NA: designators end in _NA; ports IOUT_1mA=IOUT_1mA IOUT_100uA=IOUT_100uA P5V0=P5V0 VREF_1mA=DAC2_VOUTA VREF_100uA=DAC2_VOUTB
PA: designators end in _PA; ports IOUT_1mA=IOUT_1mA IOUT_100uA=IOUT_100uA P5V0=P5V0 VREF_1mA=DAC2_VOUTC VREF_100uA=DAC2_VOUTD

### Notes on the sheet
- Symbol is poorly made,
  this is not really the "-"
  input of an opamp.
- INA597 is a similar pin-compatible replacement from TI that is in stock, use it instead.
- https://www.analog.com/en/analog-dialogue/articles/diff-amp-heart-of-precision-current-source.html
- (in symbol CMP-04895-000136-1, part A) +; -
- (in symbol CMP-04895-000136-1, part B) +; -
- (in symbol CMP-09116-000144-1, part A) +

### Library data of the parts
C22-C24 = CMP-03422-000030-1: as C1_VV on sheet voltage_adjustable_supply; Voltage Rating: 16 V; Package: CC0603-DA; ComponentLink2Description: Datasheet; Octopart: https://octopart.com/cc0603krx7r7bb104-yageo-192941; Temperature Range High: +125°C; Digikey Description: CAP CER 0.1UF 16V X7R 0603; Value: 100 nF; Voltage: 16 V; Device Class L2: Capacitors; Height: 0.9mm; Temperature: -55°C to +125°C; Device Class L1: Passive Components; Device Class L3: Ceramic Capacitors; ComponentLink2URL: http://www.yageo.com/documents/recent/UPY-GPHC_X7R_6.3V-to-50V_18.pdf; Footprint Url: http://www.yageo.com/exep/pages/download/literatures/UPY-C_GEN_24.pdf; RoHS: TRUE; Temperature Range Low: -55°C; Temperature Characteristic: X7R; Lead Free: Yes; Capacitance: 100 nF; Category: Cap; Mouser Description: Multilayer Ceramic Capacitor, CC Series, 0.1 - F, - 10%, X7R, 16 V, 0603 [1608 Metric]; Automotive: No
Q1 Q2 = CMP-1048-00538-1: General Purpose Transistor, NPN Silicon, 3-Pin SOT-23, Pb-Free, Tape and Reel; Manufacturer: On Semiconductor; fT Min (MHz): 300; IC Continuous (A): 0.6; ComponentLink3URL: http://www.onsemi.cn/pub_link/Collateral/318-08.PDF; PartNumber: MMBT2222ALT1G; RoHS: TRUE; ComponentLink1URL: http://www.onsemi.com/; ComponentLink3Description: Package Specification; ComponentLink2Description: Datasheet; Mounting Technology: Surface Mount; Packing: Tape and Reel; PackageDescription: 3-Pin Small Outline Transistor, Body 2.92 x 1.3 mm, Pitch 0.95 mm; DatasheetVersion: Rev. 10; PackageReference: SOT-23-3-318-08; ComponentLink2URL: http://www.onsemi.cn/pub_link/Collateral/MMBT2222LT1-D.PDF; Polarity: NPN; PackageVersion: Rev. AP, 11/2009; ComponentLink1Description: Manufacturer URL
R17 R18 = CMP-2000-03820-1: as R3_VV on sheet voltage_adjustable_supply
U5 U10 = CMP-09116-000144-1: IC OPAMP DIFF 1 CIRCUIT 8SOIC; Number of Elements: 1; Max Dual Supply Voltage: 18V; Slew Rate: 1.1V/µs; Max Supply Voltage: 36V; Output Current per Channel: 15mA; Common Mode Rejection Ratio: 86dB; Amplifier Type: DIFFERENTIAL; Input Resistance: 80kR; Operating Supply Current: 200uA; Min Dual Supply Voltage: 2V; Input Offset Voltage (Vos): 200uV; Gain Bandwidth Product: 550kHz; Max Operating Temperature: 125°C; RoHS Compliant: Yes; Package Quantity: 1000; Number of Pins: 8; Mount: Surface Mount; Min Operating Temperature: -40°C; Number of Channels: 1; Contact Plating: Tin; Case/Package: SOIC; Lead Free: Contains Lead; Weight: 0.019048oz; Number of Circuits: 1; Packaging: Tape and Reel; Series: -; Min Supply Voltage: 2V
U9 = CMP-04895-000136-1: IC OPAMP GP 2 CIRCUIT 8SOIC; Number of Elements: 2; Min Supply Voltage: 2.7V; Input Bias Current: 250nA; Output Current per Channel: 160mA; Bandwidth: 1MHz; Voltage Gain: 100dB; Input Offset Voltage (Vos): 7mV; Slew Rate: 1V/µs; Nominal Supply Current: 440uA; Power Supply Rejection Ratio (PSRR): 50dB; Max Supply Voltage: 5.5V; Operating Supply Current: 210uA; Lead Free: Lead Free; Length: 4.9mm; RoHS Compliant: Yes; REACH SVHC: No SVHC; Case/Package: SOIC; Height: 1.58mm; Number of Channels: 2; Number of Amplifiers: 2; Radiation Hardening: No; Number of Circuits: 2; Mount: Surface Mount; Contact Plating: Gold; Unity Gain Bandwidth Product: 1MHz; Min Operating Temperature: -40°C; Max Operating Temperature: 125°C; Width: 3.91mm; Gain Bandwidth Product: 1MHz; Number of Pins: 8; Packaging: Tape and Reel; Package Quantity: 2500; Output Current: 160mA; Common Mode Rejection Ratio: 50dB

## Sheet adjustable_biasing_pots.SchDoc
size A; SheetNumber: 5; SheetTotal: 9
Used 2 times, as channels PB, NB. Parts and nets are listed once, with the designators drawn on the sheet.
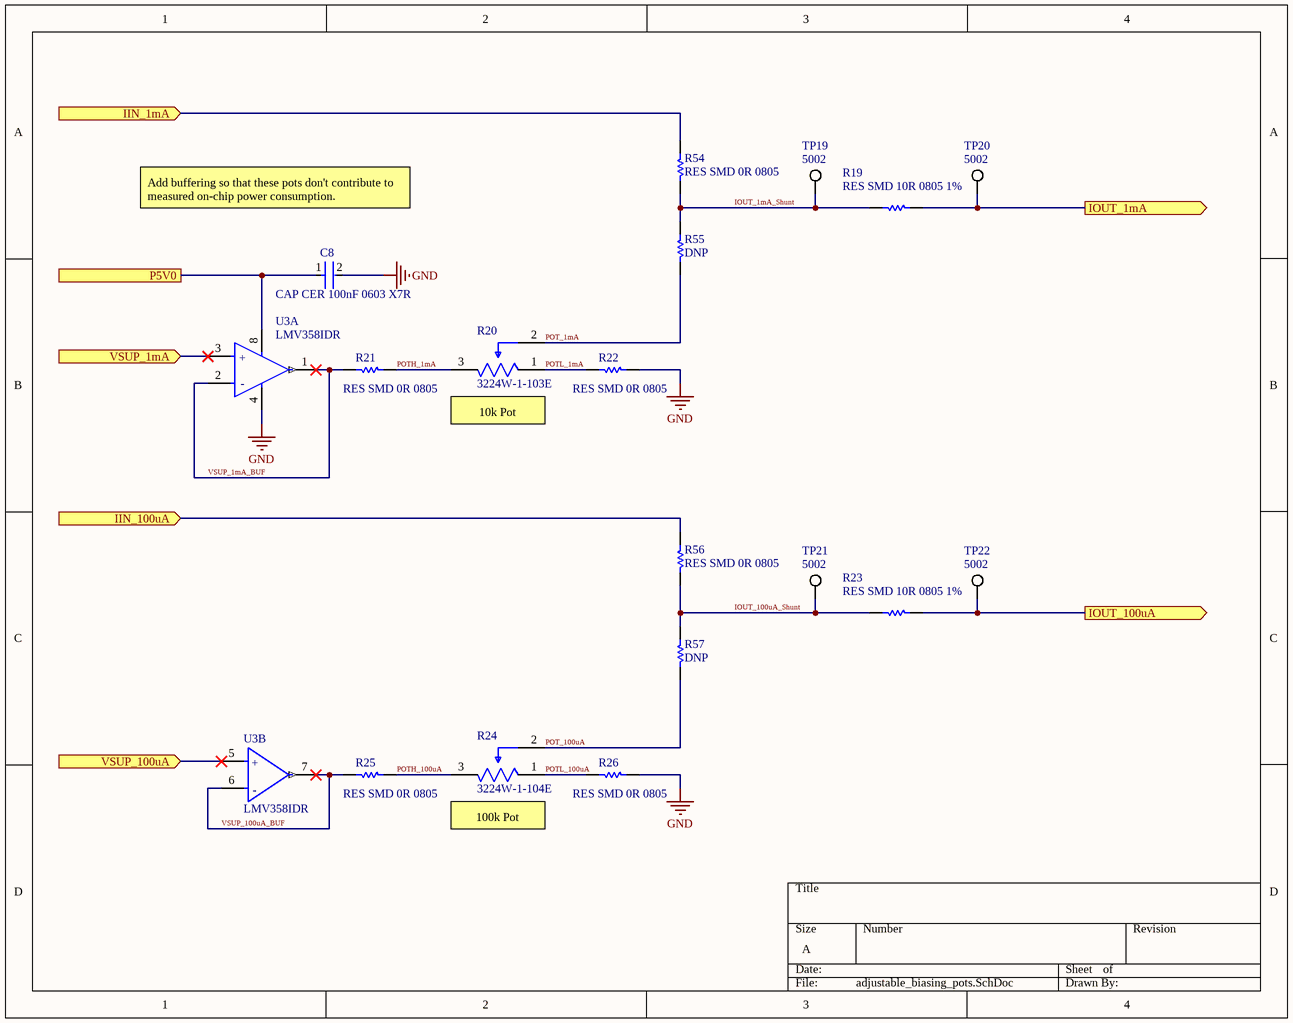
[diagram p3: adjustable_biasing_pots.SchDoc]

### Parts
C8  CAP CER 100nF 0603 X7R  [FP-CC0603-DA-MFG]
R19  RES SMD 10R 0805 1%  [RESC2013X55X40NL15T20]
R20  3224W-1-103E  [FP-3224W-MFG]
R21  RES SMD 0R 0805  [RESC2013X55X40NL15T20]
R22  RES SMD 0R 0805  [RESC2013X55X40NL15T20]
R23  RES SMD 10R 0805 1%  [RESC2013X55X40NL15T20]
R24  3224W-1-104E  [FP-3224W-MFG]
R25  RES SMD 0R 0805  [RESC2013X55X40NL15T20]
R26  RES SMD 0R 0805  [RESC2013X55X40NL15T20]
R54  RES SMD 0R 0805  [RESC2013X55X40NL15T20]
R55  DNP  [RESC2013X55X40NL15T20]
R56  RES SMD 0R 0805  [RESC2013X55X40NL15T20]
R57  DNP  [RESC2013X55X40NL15T20]
TP19  5002  [KSTN-5002]
TP20  5002  [KSTN-5002]
TP21  5002  [KSTN-5002]
TP22  5002  [KSTN-5002]
U3  LMV358IDR  [FP-D0008A-MFG]  (parts A,B of 2)

### Ports
IIN_1mA (in), IIN_100uA (in), IOUT_1mA (out), IOUT_100uA (out), P5V0, VSUP_1mA (in), VSUP_100uA (in)

### Nets
GND: C8.2 R22.2 R26.2 U3.4(GND)
IIN_1mA: R54.2 ; port IIN_1mA
IIN_100uA: R56.2 ; port IIN_100uA
IOUT_1mA: R19.2 TP20.1 ; port IOUT_1mA
IOUT_1mA_Shunt: R19.1 R54.1 R55.2 TP19.1
IOUT_100uA: R23.2 TP22.1 ; port IOUT_100uA
IOUT_100uA_Shunt: R23.1 R56.1 R57.2 TP21.1
P5V0: C8.1 U3.8(VCC+) ; port P5V0
POT_1mA: R20.2(WIPER) R55.1
POT_100uA: R24.2(WIPER) R57.1
POTH_1mA: R20.3(CW) R21.2
POTH_100uA: R24.3(CW) R25.2
POTL_1mA: R20.1(CCW) R22.1
POTL_100uA: R24.1(CCW) R26.1
VSUP_1mA: U3.3(1IN+) ; port VSUP_1mA
VSUP_1mA_BUF: R21.1 U3.1(OUT) U3.2(1IN-)
VSUP_100uA: U3.5(2IN+) ; port VSUP_100uA
VSUP_100uA_BUF: R25.1 U3.6(2IN-) U3.7(2OUT)

### Channels
PB: designators end in _PB; ports IIN_1mA=IRefPadBufPNPMirOut IIN_100uA=IRefCTIAPNPMirOut IOUT_1mA=IRefPadBuf IOUT_100uA=IRefCTIA P5V0=P5V0 VSUP_1mA=VOUT VSUP_100uA=VOUT
NB: designators end in _NB; ports IIN_1mA=IOUT_1mA IIN_100uA=IOUT_100uA IOUT_1mA=IRefCML2CMOS IOUT_100uA=IRefLocalBuf P5V0=P5V0 VSUP_1mA=VOUT VSUP_100uA=VOUT

### Notes on the sheet
- Add buffering so that these pots don't contribute to measured on-chip power consumption.
- (near R20) 10k Pot
- (near R24) 100k Pot
- (in symbol CMP-04895-000136-1, part A) +; -
- (in symbol CMP-04895-000136-1, part B) +; -

### Library data of the parts
C8 = CMP-03422-000030-1: as C1_VV on sheet voltage_adjustable_supply; Voltage Rating: 16 V; Package: CC0603-DA; ComponentLink2Description: Datasheet; Octopart: https://octopart.com/cc0603krx7r7bb104-yageo-192941; Temperature Range High: +125°C; Digikey Description: CAP CER 0.1UF 16V X7R 0603; Value: 100 nF; Voltage: 16 V; Device Class L2: Capacitors; Height: 0.9mm; Temperature: -55°C to +125°C; Device Class L1: Passive Components; Device Class L3: Ceramic Capacitors; ComponentLink2URL: http://www.yageo.com/documents/recent/UPY-GPHC_X7R_6.3V-to-50V_18.pdf; Footprint Url: http://www.yageo.com/exep/pages/download/literatures/UPY-C_GEN_24.pdf; RoHS: TRUE; Temperature Range Low: -55°C; Temperature Characteristic: X7R; Lead Free: Yes; Capacitance: 100 nF; Category: Cap; Mouser Description: Multilayer Ceramic Capacitor, CC Series, 0.1 - F, - 10%, X7R, 16 V, 0603 [1608 Metric]; Automotive: No
R19 R21-R23 R25 R26 R54-R57 = CMP-2001-04723-1: Manufacturer: Vishay Dale; Part Number: TNPW0805100RBEEA
R20 = CMP-07234-000002-1: as R5_VV on sheet voltage_adjustable_supply; Device Class L3: Variable Resistors and Potentiometers; Composition: Cermet; Temperature Range Low: -65°C; Package: 3224W; ComponentLink2Description: Datasheet; Digikey Description: TRIMMER 10K OHM 0.25W J LEAD TOP; Category: Res; Mouser Description: Trimmer Resistors - SMD 4mm 10Kohms 10% Square Cermet Sealed; Temperature: -65°C to +150°C; Device Class L2: Resistors; Device Class L1: Passive Components; RoHS: TRUE; Temperature Range High: +150°C; Manufacturer Part Number: 3224W-1-103E; ComponentLink2URL: https://upverter.com/datasheet/a166fca85da25564670351d2dc712345c058bc40.pdf; Series: 3224; Height: 5.55mm; Lead Free: Yes; Octopart: https://octopart.com/3224w-1-103e-bourns-14818; Automotive: No
R24 = CMP-07234-000002-1: TRIMMER 10K OHM 0.25W J LEAD TOP; Manufacturer: Bourns; Manufacturer Part Number: 3224W-1-103E; Tolerance: 10%; Resistance: 10kΩ; Temperature Coefficient: 100ppm/°C; Value: 10kΩ; Standoff Height: 0.2mm; Voltage Rating: 300V; Power Rating: 250mW; Device Class L3: Variable Resistors and Potentiometers; Composition: Cermet; Temperature Range Low: -65°C; Package: 3224W; ComponentLink2Description: Datasheet; Digikey Description: TRIMMER 10K OHM 0.25W J LEAD TOP; Category: Res; Mouser Description: Trimmer Resistors - SMD 4mm 10Kohms 10% Square Cermet Sealed; Temperature: -65°C to +150°C; Device Class L2: Resistors; Device Class L1: Passive Components; RoHS: TRUE; Temperature Range High: +150°C; ComponentLink2URL: https://upverter.com/datasheet/a166fca85da25564670351d2dc712345c058bc40.pdf; Series: 3224; Height: 5.55mm; Lead Free: Yes; Octopart: https://octopart.com/3224w-1-103e-bourns-14818; Automotive: No
TP19-TP22 = CMP-2000-05182-1: as TP1 on sheet isg_cena_host_board_rev1_top; Product: TestPoints; Packaging: Bulk; Manufacturer URL: http://www.keyelco.com/; Length: 7.62mm; Datasheet Version: Rev. G, 12/2008; Type: Miniature; Product Category: CircuitBoardHardware-PCB; Material: Nylon; RoHS: True; Contact Material: PhosphorBronze; Datasheet URL: https://ciiva.com/datasheet-click-2917627?src=ciiva&sig=bd195616; Color: White; Brand: KeystoneElectronics
U3 = CMP-04895-000136-1: as U9 on sheet vccs_pullup; Lead Free: Lead Free; Length: 4.9mm; RoHS Compliant: Yes; REACH SVHC: No SVHC; Case/Package: SOIC; Height: 1.58mm; Number of Channels: 2; Number of Amplifiers: 2; Radiation Hardening: No; Number of Circuits: 2; Mount: Surface Mount; Contact Plating: Gold; Unity Gain Bandwidth Product: 1MHz; Min Operating Temperature: -40°C; Max Operating Temperature: 125°C; Width: 3.91mm; Gain Bandwidth Product: 1MHz; Number of Pins: 8; Packaging: Tape and Reel; Package Quantity: 2500; Output Current: 160mA; Common Mode Rejection Ratio: 50dB

## Sheet charge_pump.SchDoc
size A; SheetNumber: 6; SheetTotal: 9
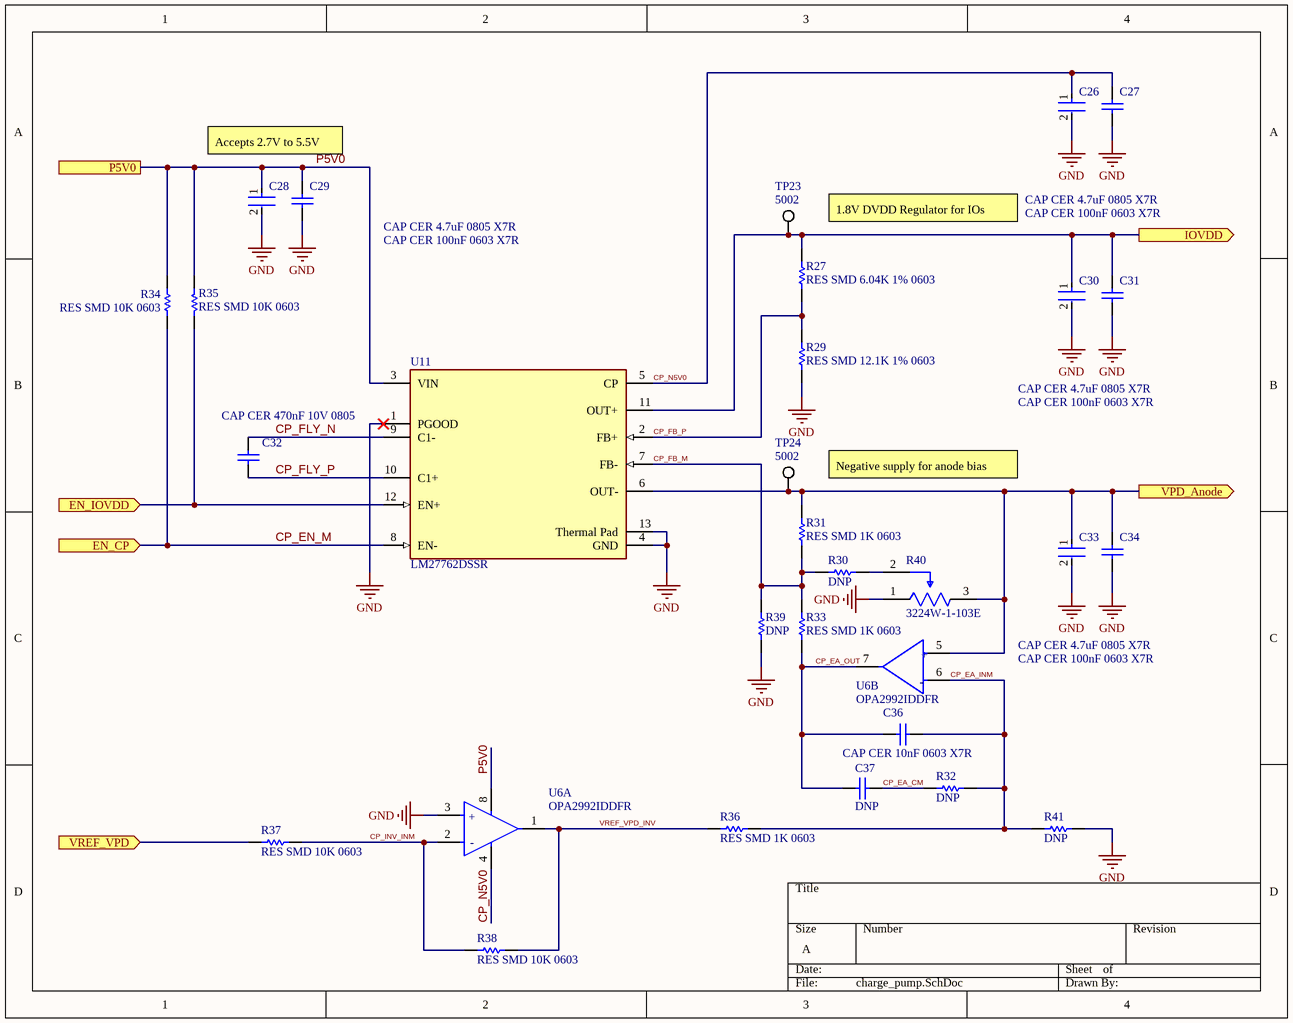
[diagram p4: charge_pump.SchDoc]

### Parts
(Parts that share a designator on the sheet are numbered #1, #2 ... from top to bottom, then left to right.)
C26#1  CAP CER 100nF 0603 X7R  [FP-CC0603-DA-MFG]
C27#1  CAP CER 4.7uF 0805 X7R  [CAPC2013X140X50NL20T25]
C28#1  CAP CER 100nF 0603 X7R  [FP-CC0603-DA-MFG]
C29#1  CAP CER 4.7uF 0805 X7R  [CAPC2013X140X50NL20T25]
C30#1  CAP CER 100nF 0603 X7R  [FP-CC0603-DA-MFG]
C31#1  CAP CER 4.7uF 0805 X7R  [CAPC2013X140X50NL20T25]
C32#1  CAP CER 470nF 10V 0805  [CAPC0805(2012)145_M]
C33#1  CAP CER 100nF 0603 X7R  [FP-CC0603-DA-MFG]
C34#1  CAP CER 4.7uF 0805 X7R  [CAPC2013X140X50NL20T25]
C36#1  CAP CER 10nF 0603 X7R  [CAPC1608X90X40ML10T20]
C37#1  DNP  [CAPC1608X90X40ML10T20]
R27  RES SMD 6.04K 1% 0603  [RESC1608X55X30LL10T20_A]
R29  RES SMD 12.1K 1% 0603  [RESC1608X55X30LL10T20_A]
R30  DNP  [RESC1608X55X30LL10T20_A]
R31  RES SMD 1K 0603  [RESC1608X55X30LL10T20_A]
R32  DNP  [RESC1609X50X30LL10T20]
R33  RES SMD 1K 0603  [RESC1608X55X30LL10T20_A]
R34  RES SMD 10K 0603  [RESC1609X55X30LL15T15]
R35  RES SMD 10K 0603  [RESC1609X55X30LL15T15]
R36  RES SMD 1K 0603  [RESC1608X55X30LL10T20_A]
R37  RES SMD 10K 0603  [RESC1608X55X30LL10T20_A]
R38  RES SMD 10K 0603  [RESC1608X55X30LL10T20_A]
R39  DNP  [RESC1608X55X30LL10T20_A]
R40#1  3224W-1-103E  [FP-3224W-MFG]
R41#1  DNP  [RESC1609X50X30LL10T20]
TP23#1  5002  [KSTN-5002]
TP24  5002  [KSTN-5002]
U6  OPA2992IDDFR  [FP-DDF0008A-MFG]  (parts A,B of 2)
U11#1  LM27762DSSR  [FP-DSS0012B-MFG]

### Ports
EN_CP (in), EN_IOVDD (in), IOVDD (out), P5V0, VPD_Anode (out), VREF_VPD (in)

### Nets
GND: C26#1.2 C27#1.2 C28#1.2 C29#1.2 C30#1.2 C31#1.2 C33#1.2 C34#1.2 R29.1 R39.1 R40#1.1(CCW) R41#1.1 U6.3(IN1+) U11#1.1(PGOOD) U11#1.4(GND) U11#1.13(Thermal_Pad)
IOVDD: C30#1.1 C31#1.1 R27.2 TP23#1.1 U11#1.11(OUT+) ; port IOVDD
P5V0: C28#1.1 C29#1.1 R34.2 R35.2 U6.8(V+) U11#1.3(VIN) ; port P5V0
VPD_Anode: C33#1.1 C34#1.1 R31.2 R40#1.3(CW) TP24.1 U6.5(IN2+) U11#1.6(OUT-) ; port VPD_Anode
CP_EA_CM: C37#1.2 R32.2
CP_EA_INM: C36#1.2 R32.1 R36.1 R41#1.2 U6.6(IN2-)
CP_EA_OUT: C36#1.1 C37#1.1 R33.1 U6.7(OUT2)
CP_EN_M: R34.1 U11#1.8(EN-) ; port EN_CP
CP_FB_M: R30.2 R31.1 R33.2 R39.2 U11#1.7(FB-)
CP_FB_P: R27.1 R29.2 U11#1.2(FB+)
CP_FLY_N: C32#1.2 U11#1.9(C1-)
CP_FLY_P: C32#1.1 U11#1.10(C1+)
CP_INV_INM: R37.1 R38.2 U6.2(IN1-)
CP_N5V0: C26#1.1 C27#1.1 U6.4(V-) U11#1.5(CP)
DAC1_VOUTD: R37.2 ; port VREF_VPD
EN_IOVDD: R35.1 U11#1.12(EN+) ; port EN_IOVDD
VREF_VPD_INV: R36.2 R38.1 U6.1(OUT1)
NetR30_1: R30.1 R40#1.2(WIPER)

### Notes on the sheet
- Accepts 2.7V to 5.5V
- 1.8V DVDD Regulator for IOs
- Negative supply for anode bias
- (in symbol CMP-04895-000462-1, part A) +; -
- (in symbol CMP-04895-000462-1, part B) +; -

### Library data of the parts
C26#1 C28#1 C30#1 C33#1 = CMP-03422-000030-1: as C1_VV on sheet voltage_adjustable_supply; Voltage Rating: 16 V; Package: CC0603-DA; ComponentLink2Description: Datasheet; Octopart: https://octopart.com/cc0603krx7r7bb104-yageo-192941; Temperature Range High: +125°C; Digikey Description: CAP CER 0.1UF 16V X7R 0603; Value: 100 nF; Voltage: 16 V; Device Class L2: Capacitors; Height: 0.9mm; Temperature: -55°C to +125°C; Device Class L1: Passive Components; Device Class L3: Ceramic Capacitors; ComponentLink2URL: http://www.yageo.com/documents/recent/UPY-GPHC_X7R_6.3V-to-50V_18.pdf; Footprint Url: http://www.yageo.com/exep/pages/download/literatures/UPY-C_GEN_24.pdf; RoHS: TRUE; Temperature Range Low: -55°C; Temperature Characteristic: X7R; Lead Free: Yes; Capacitance: 100 nF; Category: Cap; Mouser Description: Multilayer Ceramic Capacitor, CC Series, 0.1 - F, - 10%, X7R, 16 V, 0603 [1608 Metric]; Automotive: No
C27#1 C29#1 C31#1 C34#1 = CMP-2007-04677-1: as C3_VV on sheet voltage_adjustable_supply
C32#1 = CMP-1036-04629-1: CAP 470nF 10V ±5% 0805 (2012 Metric) Thickness 1.45mm SMD; Case-EIA: 0805; Case-Metric: 2012; Tolerance: Â±5%; Max Thickness: 1.45 mm; Rated Voltage: 10 V; Technology: SMT; Value: 470nF
C36#1 = CMP-2100-03600-1: as C5_VV on sheet voltage_adjustable_supply; Lead Free: LeadFree; Case/Package: 0603; Datasheet Version: Rev. 15, 10/2016; Composition: Ceramic; Radiation Hardening: No; Thickness: 0.035inch; RoHSCompliant: True; Dielectric: X7R; Termination: SMD/SMT; Capacitance: 10nF; Manufacturer URL: http://www.yageo.com/; Tolerance: 10%; REACH SVHC: NoSVHC; Voltage: 50V; Max Operating Temperature: 125degC; Case Code (Metric): 1608; Package Quantity: 1; Case Code (Imperial): 0603; Packaging: TapeandReel; Package Reference: 0603; Width: 0.031inch; Datasheet URL: http://www.yageo.com/documents/recent/UPY-GPHC_X7R_6.3V-to-50V_15.pdf; Length: 1.6mm; Min Operating Temperature: -55degC; Number of Pins: 2; Depth: 0.8mm; Mount: SurfaceMount; Height: 0.8mm; Voltage Rating: 50V; Package Description: 2-Pin Surface Mount Device, Body 1.6 x 0.8 mm
C37#1 = CMP-2100-03600-1: as C7_VV on sheet voltage_adjustable_supply; Lead Free: LeadFree; Case/Package: 0603; Datasheet Version: Rev. 15, 10/2016; Composition: Ceramic; Radiation Hardening: No; Thickness: 0.035inch; RoHSCompliant: True; Termination: SMD/SMT; Manufacturer URL: http://www.yageo.com/; Tolerance: 10%; REACH SVHC: NoSVHC; Voltage: 50V; Max Operating Temperature: 125degC; Case Code (Metric): 1608; Package Quantity: 1; Case Code (Imperial): 0603; Packaging: TapeandReel; Package Reference: 0603; Width: 0.031inch; Datasheet URL: http://www.yageo.com/documents/recent/UPY-GPHC_X7R_6.3V-to-50V_15.pdf; Length: 1.6mm; Min Operating Temperature: -55degC; Number of Pins: 2; Depth: 0.8mm; Mount: SurfaceMount; Height: 0.8mm; Voltage Rating: 50V; Package Description: 2-Pin Surface Mount Device, Body 1.6 x 0.8 mm
R27 R29-R31 R33 R36-R39 = CMP-2000-06686-1: Chip Resistor, 0 Ohm, +/- 5%, 100 mW, -55 to 155 degC, 0603 (1608 Metric), RoHS, Tape and Reel; Manufacturer: Rohm; Tolerance: Jumper; Power (Watts): 0.1W,1/10W; Resistance (Ohms): 0.0; Online Catalog: MCR03Series; EDA / CAD Models: DownloadfromAcceleratedDesigns; Other Names: RHM0.0CGTR; Series: MCR; Package Description: 2-Pin Surface Mount Device, Body 1.60 x 0.80 mm; Composition: ThickFilm; Height: 0.022"(0.55mm); Mounting Technology: SurfaceMount; Family: ChipResistor-SurfaceMount; Temperature Coefficient: -; Category: Resistors; Supplier Device Package: 0603(1608Metric); Package Reference: 0603; Size / Dimension: 0.063"Lx0.031"W(1.60mmx0.80mm); Standard Package: 5,000; Datasheet URL: http://www.rohm.com/web/global/datasheet/MCR03ERTJ; Features: -; Datasheet Version: Rev. F, 02/2015; Operating Temperature: -55°C~155°C; Package / Case: 0603(1608Metric); Manufacturer URL: http://www.rohm.com/web/global/; Packaging: Tape&Reel(TR); Number of Terminations: 2
R32 R41#1 = CMP-2000-03820-1: as R2_VV on sheet voltage_adjustable_supply
R34 R35 = CMP-2000-07452-1: Chip Resistor, 10 KOhm, +/- 1%, 0.1 W, -55 to 155 degC, 0603 (1608 Metric), RoHS, Tape and Reel; Manufacturer: Panasonic; Voltage Rating: 75V; Case\/Package: 0603; Power Rating: 100mW; Resistance: 10KOhm; Temperature Coefficient: 100ppm\/degreesC; Number of Pins: 2; Package Reference: 603; Depth: 0.8mm; Mount: SurfaceMount; Package Description: 2-Pin Surface Mount Device, Body 1.6 x 0.85 mm; Datasheet Version: 02/2017; Length: 1.6mm; Lead Free: LeadFree; Height: 0.45mm; Number of Terminations: 2; Max Power Dissipation: 100mW; Min Operating Temperature: -55degC; Datasheet URL: https://industrial.panasonic.com/cdbs/www-data/pdf/RDA0000/AOA0000C304.pdf; Termination: SMD/SMT; Case Code (Metric): 1608; Case Code (Imperial): 0603; Tolerance: 1%; Max Operating Temperature: 155degC; RoHSCompliant: true; Voltage Rating (DC): 75V; Radiation Hardening: No; Packaging: TapeandReel; Composition: ThickFilm; Mounting Technology: SurfaceMount; Manufacturer URL: http://www.panasonic.com/; Width: 0.031inch; REACH SVHC: NoSVHC; Contact Plating: Tin; Military Standard: Not; Package Quantity: 1
R40#1 = CMP-07234-000002-1: as R5_VV on sheet voltage_adjustable_supply; Device Class L3: Variable Resistors and Potentiometers; Composition: Cermet; Temperature Range Low: -65°C; Package: 3224W; ComponentLink2Description: Datasheet; Digikey Description: TRIMMER 10K OHM 0.25W J LEAD TOP; Category: Res; Mouser Description: Trimmer Resistors - SMD 4mm 10Kohms 10% Square Cermet Sealed; Temperature: -65°C to +150°C; Device Class L2: Resistors; Device Class L1: Passive Components; RoHS: TRUE; Temperature Range High: +150°C; Manufacturer Part Number: 3224W-1-103E; ComponentLink2URL: https://upverter.com/datasheet/a166fca85da25564670351d2dc712345c058bc40.pdf; Series: 3224; Height: 5.55mm; Lead Free: Yes; Octopart: https://octopart.com/3224w-1-103e-bourns-14818; Automotive: No
TP23#1 TP24 = CMP-2000-05182-1: as TP1 on sheet isg_cena_host_board_rev1_top; Product: TestPoints; Packaging: Bulk; Manufacturer URL: http://www.keyelco.com/; Length: 7.62mm; Datasheet Version: Rev. G, 12/2008; Type: Miniature; Product Category: CircuitBoardHardware-PCB; Material: Nylon; RoHS: True; Contact Material: PhosphorBronze; Datasheet URL: https://ciiva.com/datasheet-click-2917627?src=ciiva&sig=bd195616; Color: White; Brand: KeystoneElectronics
U6 = CMP-04895-000462-1: IC OPAMP GP 2 CIRCUIT TSOT23-8
U11#1 = CMP-04918-000139-1: IC REG CHARGE PUMP ADJ DL 12WSON; Switching Frequency: 2.3MHz; Output Current: 250mA; Output Type: Adjustable; Min Output Voltage: 1.5V; Min Input Voltage: 2.7V; Synchronous Rectifier: No; Quiescent Current: 390uA; Max Input Voltage: 5.5V; Max Output Voltage: 5V; Mount: Surface Mount; Lead Free: Lead Free; Topology: Charge Pump; Max Operating Temperature: 85°C; Min Operating Temperature: -40°C; Packaging: Tape and Reel